# EAGLE design simpleCH552_typeA_sch_finished (EAGLE 9.6.2)
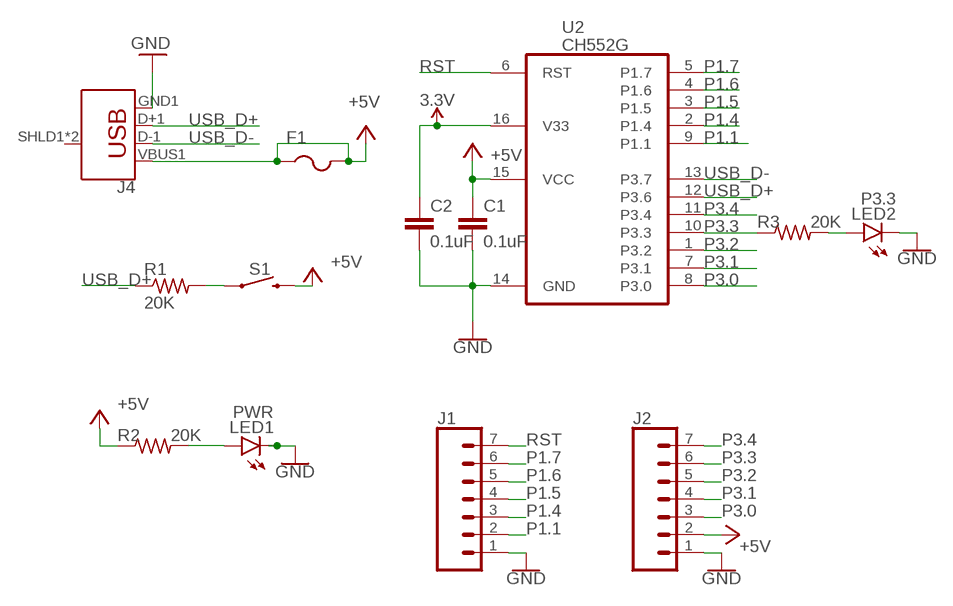
[diagram p0: schematic, sheet 1]

## Parts
C1  0.1uF  C-EUC0805K  [C0805K]
C2  0.1uF  C-EUC0805K  [C0805K]
F1  PTCFUSE-1206  [R1206]
J1  CONN_07NO_SILK  [1X07_NO_SILK]
J2  CONN_07NO_SILK  [1X07_NO_SILK]
J4  USB_A_SMT_MALE  [USB-A-SMT-MALE]
LED1  PWR  GHI-BASICCOMPONENTS_LED-(INCH)-0805  [GHI-BASICCOMPONENTS_0805-LED]
LED2  P3.3  GHI-BASICCOMPONENTS_LED-(INCH)-0805  [GHI-BASICCOMPONENTS_0805-LED]
R1  20K  R-US_R0805  [R0805]
R2  20K  R-US_R0805  [R0805]
R3  20K  R-US_R0805  [R0805]
S1  MOMENTARY-SWITCH-SPST-SMD-6.2MM-TALL  [TACTILE_SWITCH_SMD_6.2MM_TALL]
U2  CH552G  MY_IC_CH551G_CH552GSOP-16  [MY_IC_SO16]

## Nets
3.3V: C2.1 U2.16(V33)
+5V: C1.1 F1.1 F1.2 J2.2 J4.VBUS1(VBUS) R2.1 S1.B2 U2.15(VCC)
GND: C1.2 C2.2 J1.1 J2.1 J4.GND1(GND) LED1.K LED2.K U2.14(GND)
N$1: R1.2 S1.A2
N$2: LED2.A R3.2
N$3: LED1.A R2.2
P1.1: J1.2 U2.9(P1.1)
P1.4: J1.3 U2.2(P1.4)
P1.5: J1.4 U2.3(P1.5)
P1.6: J1.5 U2.4(P1.6)
P1.7: J1.6 U2.5(P1.7)
P3.0: J2.3 U2.8(P3.0)
P3.1: J2.4 U2.7(P3.1)
P3.2: J2.5 U2.1(P3.2)
P3.3: J2.6 R3.1 U2.10(P3.3)
P3.4: J2.7 U2.11(P3.4)
RST: J1.7 U2.6(RST)
USB_D+: J4.D+1(D+) R1.1 U2.12(P3.6)
USB_D-: J4.D-1(D-) U2.13(P3.7)
Unconnected: J4.SHLD1(SHIELD) J4.SHLD2(SHIELD)

## Library data of the parts
C1 C2 = rcl:C-EU: CAPACITOR, European symbol; LCSC: C16834; SPICEPREFIX: C
F1 = adafruit:PTCFUSE: PTC fuses, resettable thermistors; LCSC: C151162
J1 J2 = SparkFun-Connectors:CONN_07: Multi connection point. Often used as Generic Header-pin footprint for 0.1 inch spaced/style header connections On any of the 0.1 inch spaced packages, you can populate with these: Break Away Headers - Straight <https://www.sparkfun.com/products/116> (PRT-00116) Break Away Male Headers - Right Angle <https://www.sparkfun.com/products/553> (PRT-00553) Female Headers <https://www.sparkfun.com/products/115> (PRT-00115) Break Away Headers - Machine Pin <https://www.sparkfun.com/products/117> (PRT-00117) Break Away Female Headers - Swiss Machine Pin <https://www.sparkfun.com/products/743> (PRT-00743) For SCREWTERMINALS and SPRING TERMINALS visit here: Screw Terimnals on SparkFun.com <https://www.sparkfun.com/search/results?term=Screw+Terminals> (5mm/3.5mm/2.54mm spacing) This device is also useful as a general connection point to wire up your design to another part of your project. Our various solder wires solder well into these plated through hole pads. Hook-Up Wire - Assortment (Stranded, 22 AWG) <https://www.sparkfun.com/products/11375> (PRT-11375) Hook-Up Wire - Assortment (Solid Core, 22 AWG) <https://www.sparkfun.com/products/11367> (PRT-11367) View the entire wire category on our website here <https://www.sparkfun.com/categories/141> Special notes: Molex polarized connector foot print use with SKU : PRT-08231 with associated crimp pins and housings. 1MM SMD Version SKU: PRT-10208 NOTES ON THE VARIANTS LOCK and LOCK_LONGPADS... This footprint was designed to help hold the alignment of a through-hole component (i.e. 6-pin header) while soldering it into place. You may notice that each hole has been shifted either up or down by 0.005 of an inch from it's more standard position (which is a perfectly straight line). This slight alteration caused the pins (the squares in the middle) to touch the edges of the holes. Because they are alternating, it causes a "brace" to hold the component in place. 0.005 has proven to be the perfect amount of "off-center" position when using our standard breakaway headers. Although looks a little odd when you look at the bare footprint, once you have a header in there, the alteration is very hard to notice. Also,if you push a header all the way into place, it is covered up entirely on the bottom side.
J4 = SparkFun-Connectors:USB_A: USB-A Connector Male and female variants, as well as PTH and SMT variants SparkFun Products: SparkFun XBee Explorer Dongle <https://www.sparkfun.com/products/11697> PTH Male SparkFun MicroView-USB Programmer <https://www.sparkfun.com/products/12924> SMT Male SparkFun USB Type A Female Breakout <https://www.sparkfun.com/products/12700> SMT Female; PROD_ID: CONN-11499
LED1 LED2 = BeagleBone_Black_Wireless:GHI-BASICCOMPONENTS_LED-(INCH)-
R1-R3 = rcl:R-US_: RESISTOR, American symbol; SPICEPREFIX: R
S1 = SparkFun-Switches:MOMENTARY-SWITCH-SPST: Momentary Switch (Pushbutton) - SPST Normally-open (NO) SPST momentary switches (buttons, pushbuttons). Variants PTH-12MM - 12mm square, through-hole Momentary Pushbutton Switch - 12mm Square <https://www.sparkfun.com/products/9190> (COM-09190) PTH-6.0MM, PTH-6.0MM-KIT - 6.0mm square, through-hole Mini Pushbutton Switch <https://www.sparkfun.com/products/97> (COM-00097) KIT package intended for soldering kit's - only one side of pads' copper is exposed. PTH-RIGHT-ANGLE-KIT - Right-angle, through-hole Right Angle Tactile Button <https://www.sparkfun.com/products/10791> - Used on SparkFun BigTime Watch Kit <https://www.sparkfun.com/products/11734> SMD-12MM - 12mm square, surface-mount Tactile Button - SMD (12mm) <https://www.sparkfun.com/products/12993> (COM-12993) Used on SparkFun PicoBoard <https://www.sparkfun.com/products/11888> SMD-4.5MM - 4.5mm Square Trackball Switch Used on SparkFun Blackberry Trackballer Breakout <https://www.sparkfun.com/products/13169> SMD-4.6MMX2.8MM - 4.60mm x 2.80mm, surface mount Used on SparkFun SAMD21 Mini Breakout <https://www.sparkfun.com/products/13664> SMD-5.2MM, SMD-5.2-REDUNDANT - 5.2mm square, surface-mount Mini Pushbutton Switch - SMD <https://www.sparkfun.com/products/8720> (COM-08720) Used on Arduino Pro Mini <https://www.sparkfun.com/products/11114> REDUNDANT package connects both switch circuits together SMD-6.0X3.5MM - 6.0 x 3.5mm, surface mount Momentary Reset Switch SMD <https://www.sparkfun.com/products/8229> (COM-08229) SMD-6.2MM-TALL - 6.2mm square, surface mount Tactile Button - SMD (6mm) <https://www.sparkfun.com/products/12992> Used on SparkFun Digital Sandbox <https://www.sparkfun.com/products/12651> SMD-RIGHT-ANGLE - Right-angle, surface mount Used on SparkFun Block for Intel® Edison - Arduino <https://www.sparkfun.com/products/13036>; PROD_ID: SWCH-11966; SF_SKU: COM-12992
U2 = myOwnLib:MY_IC_CH551G_CH552G; LCSC: C111292

## Board
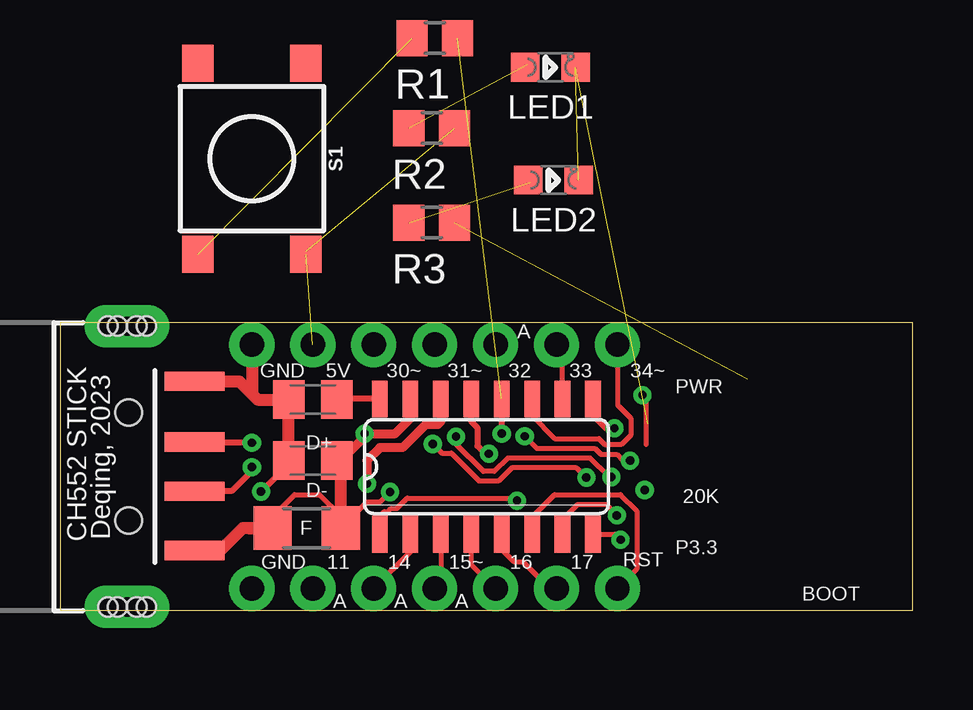
[diagram p1: board, top side]
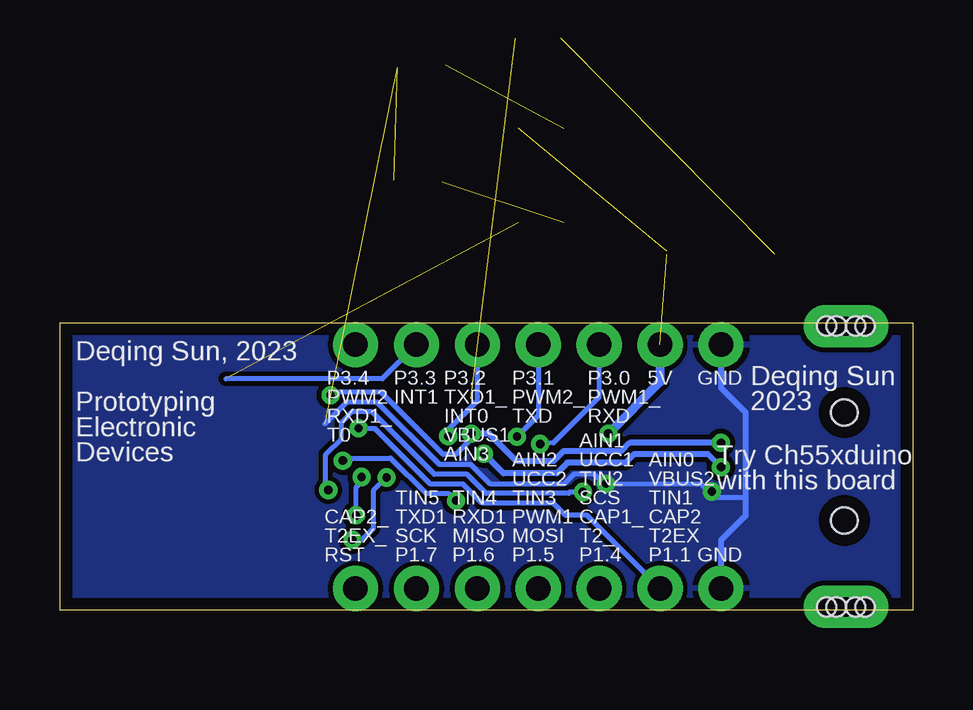
[diagram p2: board, bottom side, seen from below]

Size 35.56 x 11.99 mm. Coordinates in mm from the lower left corner, seen from the top.
Outline: 0,0 35.56,0 35.56,11.99 0,11.99 0,0
Copper layers (1*16): Top 0.035mm / dielectric 1.5mm / Bottom 0.035mm
Design rules "eagleRules10Mil *": minimum track width 8mil, minimum drill 0.3mm, track to track 8mil, track to pad 8mil, pad to pad 8mil, via to via 8mil, smd to smd 8mil, copper to edge 20mil, drill to drill 20mil, minimum pad ring 10mil, minimum via ring 8mil, stop-mask expansion 4mil, vias tented up to drill 14mil, thermal gap 10mil

### Footprints (pad centres in the part's own frame; a part is rotated, then mirrored left to right if it is on the bottom)
C0805K = smd 1.3 x 1.6: 1 -1,0; 2 1,0
R1206 = smd 1.6 x 1.803: 1 -1.422,0; 2 1.422,0
1X07_NO_SILK = drill 1.016 pad 1.88: 1 0,0; 2 2.54,0; 3 5.08,0; 4 7.62,0; 5 10.16,0; 6 12.7,0; 7 15.24,0
USB-A-SMT-MALE = smd 2.5 x 0.8: D+1 10.95,1.027; D-1 10.95,-1.027; GND1 10.95,3.551; VBUS1 10.95,-3.5 | drill 0.8 pad 1.778 long: SHLD1 8.13,-5.85; SHLD2 8.13,5.85 | hole 1.1: 8.2,2.25; 8.2,-2.25 | hole 0.8: 8.53,-5.85; 8.93,-5.85; 7.73,-5.85; 7.33,-5.85; 8.53,5.85; 8.93,5.85; 7.73,5.85; 7.33,5.85
GHI-BASICCOMPONENTS_0805-LED = smd 1.2 x 1.2: A 0,1.05; K 0,-1.05
R0805 = smd 1.3 x 1.5: 1 -0.95,0; 2 0.95,0
TACTILE_SWITCH_SMD_6.2MM_TALL = smd 1.55 x 1.3: A1 -3.975,-2.25; A2 3.975,-2.25; B1 -3.975,2.25; B2 3.975,2.25
MY_IC_SO16 = smd 0.66 x 1.524: 1 -4.445,-2.819; 2 -3.175,-2.819; 3 -1.905,-2.819; 4 -0.635,-2.819; 5 0.635,-2.819; 6 1.905,-2.819; 7 3.175,-2.819; 8 4.445,-2.819; 9 4.445,2.819; 10 3.175,2.819; 11 1.905,2.819; 12 0.635,2.819; 13 -0.635,2.819; 14 -1.905,2.819; 15 -3.175,2.819; 16 -4.445,2.819

### Placement (x,y rotation side)
C1  10.54,6.25 180 top
C2  10.54,8.79 180 top
F1  10.29,3.43 0 top
J1  8,0.91 0 top
J2  8,11.07 0 top
J4  -5.33,5.99 0 top
LED1  20.45,22.63 90 top  (outside the outline)
LED2  20.57,17.93 90 top  (outside the outline)
R1  15.62,23.85 180 top  (outside the outline)
R2  15.49,20.09 180 top  (outside the outline)
R3  15.49,16.15 180 top  (outside the outline)
S1  8,18.82 270 top
U2  17.78,5.99 0 top

### Tracks (layer width: path | path; a pad name or v marks a point on that pad's centre or on a via)
3.3V
  Top 0.254: U2.16 11.57,8.81 C2.1
+5V  (via drill 0.35)  (2 unrouted)
  Top 0.203: F1.1 8.87,3.91 9.78,4.83 10.82,4.83 11.71,3.94 | F1.2 12.8,4.52 13.35,4.52 v13.76,4.93 | S1.B2 10.25,14.96
  Top 0.254: C1.1 11.71,6.25 | 12.7,7.24 v12.7,7.37
  Top 0.305: 11.71,6.25 11.56,6.25 C1.1
  Top 0.381: v12.7,7.37 13.97,7.37 14.61,8 U2.15 | 11.71,6.25 12.7,7.24
  Top 0.508: F1.2 11.71,3.94 11.71,6.1 11.56,6.25 | 7.84,3.43 F1.1 7.62,3.43 6.73,2.54 5.66,2.54 J4.VBUS1
  Bottom 0.203: v13.76,4.93 14.3,4.93 14.36,4.88 17.8,4.88 18.58,5.66 19.95,5.66 22.55,8.27 23.4,8.27 23.82,7.84 23.82,7.16 24.49,6.5 24.49,5.33 24.37,5.22 v24.37,5.02
  Bottom 0.381: J2.2 10.54,9.53 v12.7,7.37
GND  (via drill 0.35)  (2 unrouted)
  Top 0.254: C1.2 9.54,6.11 v8.38,4.95
  Top 0.381: v12.8,5.28 12.8,6.25 13.34,6.78 14.28,6.78 15.24,7.75 15.75,7.75 15.88,7.87 U2.14
  Top 0.508: C1.2 C2.2 8.23,8.79 8,9.02 | J2.1 8,9.02 | J4.GND1 7.47,9.54 8,9.02
  Bottom 0.203: 6.99,4.7 8.26,4.7 8.84,5.28 v12.8,5.28 12.9,5.28 13.31,5.69 14.12,5.69 14.53,5.28 17.63,5.28 18.41,6.07 19.73,6.07 22.34,8.68 23.61,8.68 24.51,7.77
  Bottom 0.254: J2.1 8,9.27 6.99,8.26 6.99,4.7 6.99,3.94 8,2.92 J1.1
  pour Bottom: 0,0 35.56,0 35.56,11.99 0,11.99
N$1  (1 unrouted)
  Top 0.203: 5.79,14.81 S1.A2
N$2  (1 unrouted)
  Top 0.203: 19.62,17.83 LED2.A
N$3  (1 unrouted)
  Top 0.203: 19.5,22.73 LED1.A
P1.1  (via drill 0.35)
  Top 0.203: v23.11,7.59 22.74,7.59 22.2,8.13 22.2,8.79 U2.9
  Bottom 0.203: J1.2 13.59,3.96 14.48,3.96 14.99,4.47 17.96,4.47 18.75,5.26 20.11,5.26 22.45,7.59 v23.11,7.59
P1.4
  Top 0.203: U2.2 14.61,2.44 J1.3
P1.5
  Top 0.203: U2.3 15.88,1.17 J1.4
P1.6
  Top 0.203: U2.4 17.14,1.93 J1.5
P1.7
  Top 0.203: U2.5 18.41,2.54 18.92,2.03 19.3,2.03 20.24,1.09 20.52,1.09 J1.6
P3.0  (via drill 0.35)
  Top 0.203: v15.54,6.93 15.93,6.55 16.32,6.55 17.48,5.38 18.28,5.38 18.84,5.94 21.54,5.94 v21.95,5.54 | U2.8 23.14,3.17 v23.37,2.95
  Bottom 0.203: J2.3 13.08,8.89 14.99,6.99 v15.54,6.93 | v23.37,2.95 22.96,2.95 22.5,3.4 22.5,4.98 v21.95,5.54
P3.1  (via drill 0.35)
  Top 0.203: v16.51,7.24 16.51,6.93 17.65,5.79 18.11,5.79 18.67,6.35 22.1,6.35 22.89,5.56 v22.99,5.56 | U2.7 20.95,3.79 21.59,4.42 22.76,4.42 v23.22,3.96
  Bottom 0.203: J2.4 15.62,8.13 v16.51,7.24 | v23.22,3.96 23.22,5.13 22.99,5.36 v22.99,5.56
P3.2  (via drill 0.35)
  Top 0.203: U2.1 13.34,3.94 13.51,4.12 13.67,4.12 13.8,4.25 14.04,4.25 14.48,4.68 18.94,4.68 v19.05,4.58 | v19.38,7.26 19.88,6.76 22.3,6.76 22.56,6.5 23.21,6.5 23.47,6.24 v23.77,6.24
  Bottom 0.203: J2.5 18.16,8.74 19.38,7.52 v19.38,7.26 | v19.05,4.58 19.33,4.85 20.28,4.85 21.77,6.34 23.66,6.34 v23.77,6.24
P3.3  (1 unrouted)
  Top 0.203: U2.10 20.95,10.82 J2.6
  Bottom 0.203: J2.6 22.12,9.65 28.65,9.65
P3.4
  Top 0.203: U2.11 19.68,8.1 20.62,7.16 22.47,7.16 22.72,6.91 22.83,6.91 23.4,6.91 23.8,7.31 23.8,8 23.24,8.56 J2.7
RST
  Top 0.203: U2.6 19.68,3.89 20.62,4.83 23.37,4.83 24.05,4.14 24.05,1.72 J1.7
USB_D+  (via drill 0.35)  (1 unrouted)
  Top 0.203: v24.28,8.97 24.43,8.81 24.43,6.91
  Top 0.254: U2.12 v18.41,7.37 | v8,6.99 5.65,6.99 J4.D+1
  Bottom 0.203: v18.41,7.37 18.41,7.14 19.05,6.5 19.58,6.5 22.17,9.09 24.16,9.09 v24.28,8.97
  Bottom 0.254: v18.41,7.37 17.67,7.37 16.52,6.22 14.99,6.22 14.57,6.64 12.15,6.64 11.81,6.99 v8,6.99
USB_D-  (via drill 0.35)
  Top 0.254: v8,5.97 8,5.82 7.18,4.99 7.15,4.97 J4.D-1 | U2.13 17.14,7.87 17.4,7.62 17.4,6.86 17.73,6.53 v17.88,6.53
  Bottom 0.254: v8,5.97 8.56,6.53 11.62,6.53 12,6.15 14.41,6.15 14.85,5.71 17.07,5.71 v17.88,6.53

### Text on the board
tNames: A | GND | 5V | 30~ | 31~ | 32 | 33 | 34~ | PWR | D+ | D- | 20K | CH552 STICK | Deqing, 2023 | F | GND | 11 | 14 | 15~ | 16 | 17 | RST | P3.3 | A | A | A | BOOT
bNames: GND | 5V | P3.0 / PWM1_ / RXD | P3.1 / PWM2_ / TXD | P3.2 / TXD1_ / INT0 / VBUS1 / AIN3 | P3.3 / INT1 | P3.4 / PWM2 / RXD1_ / T0 | Deqing Sun / 2023 | Deqing Sun, 2023 / / Prototyping / Electronic / Devices | Try Ch55xduino / with this board | GND | AIN0 / VBUS2 / TIN1 / CAP2 / T2EX / P1.1 | AIN1 / UCC1 / TIN2 / SCS / CAP1_ / T2_ / P1.4 | AIN2 / UCC2 / TIN3 / PWM1 / MOSI / P1.5 | TIN4 / RXD1 / MISO / P1.6 | TIN5 / TXD1 / SCK / P1.7 | CAP2_ / T2EX_ / RST